# EAGLE design BaseModule (EAGLE 9.6.2)
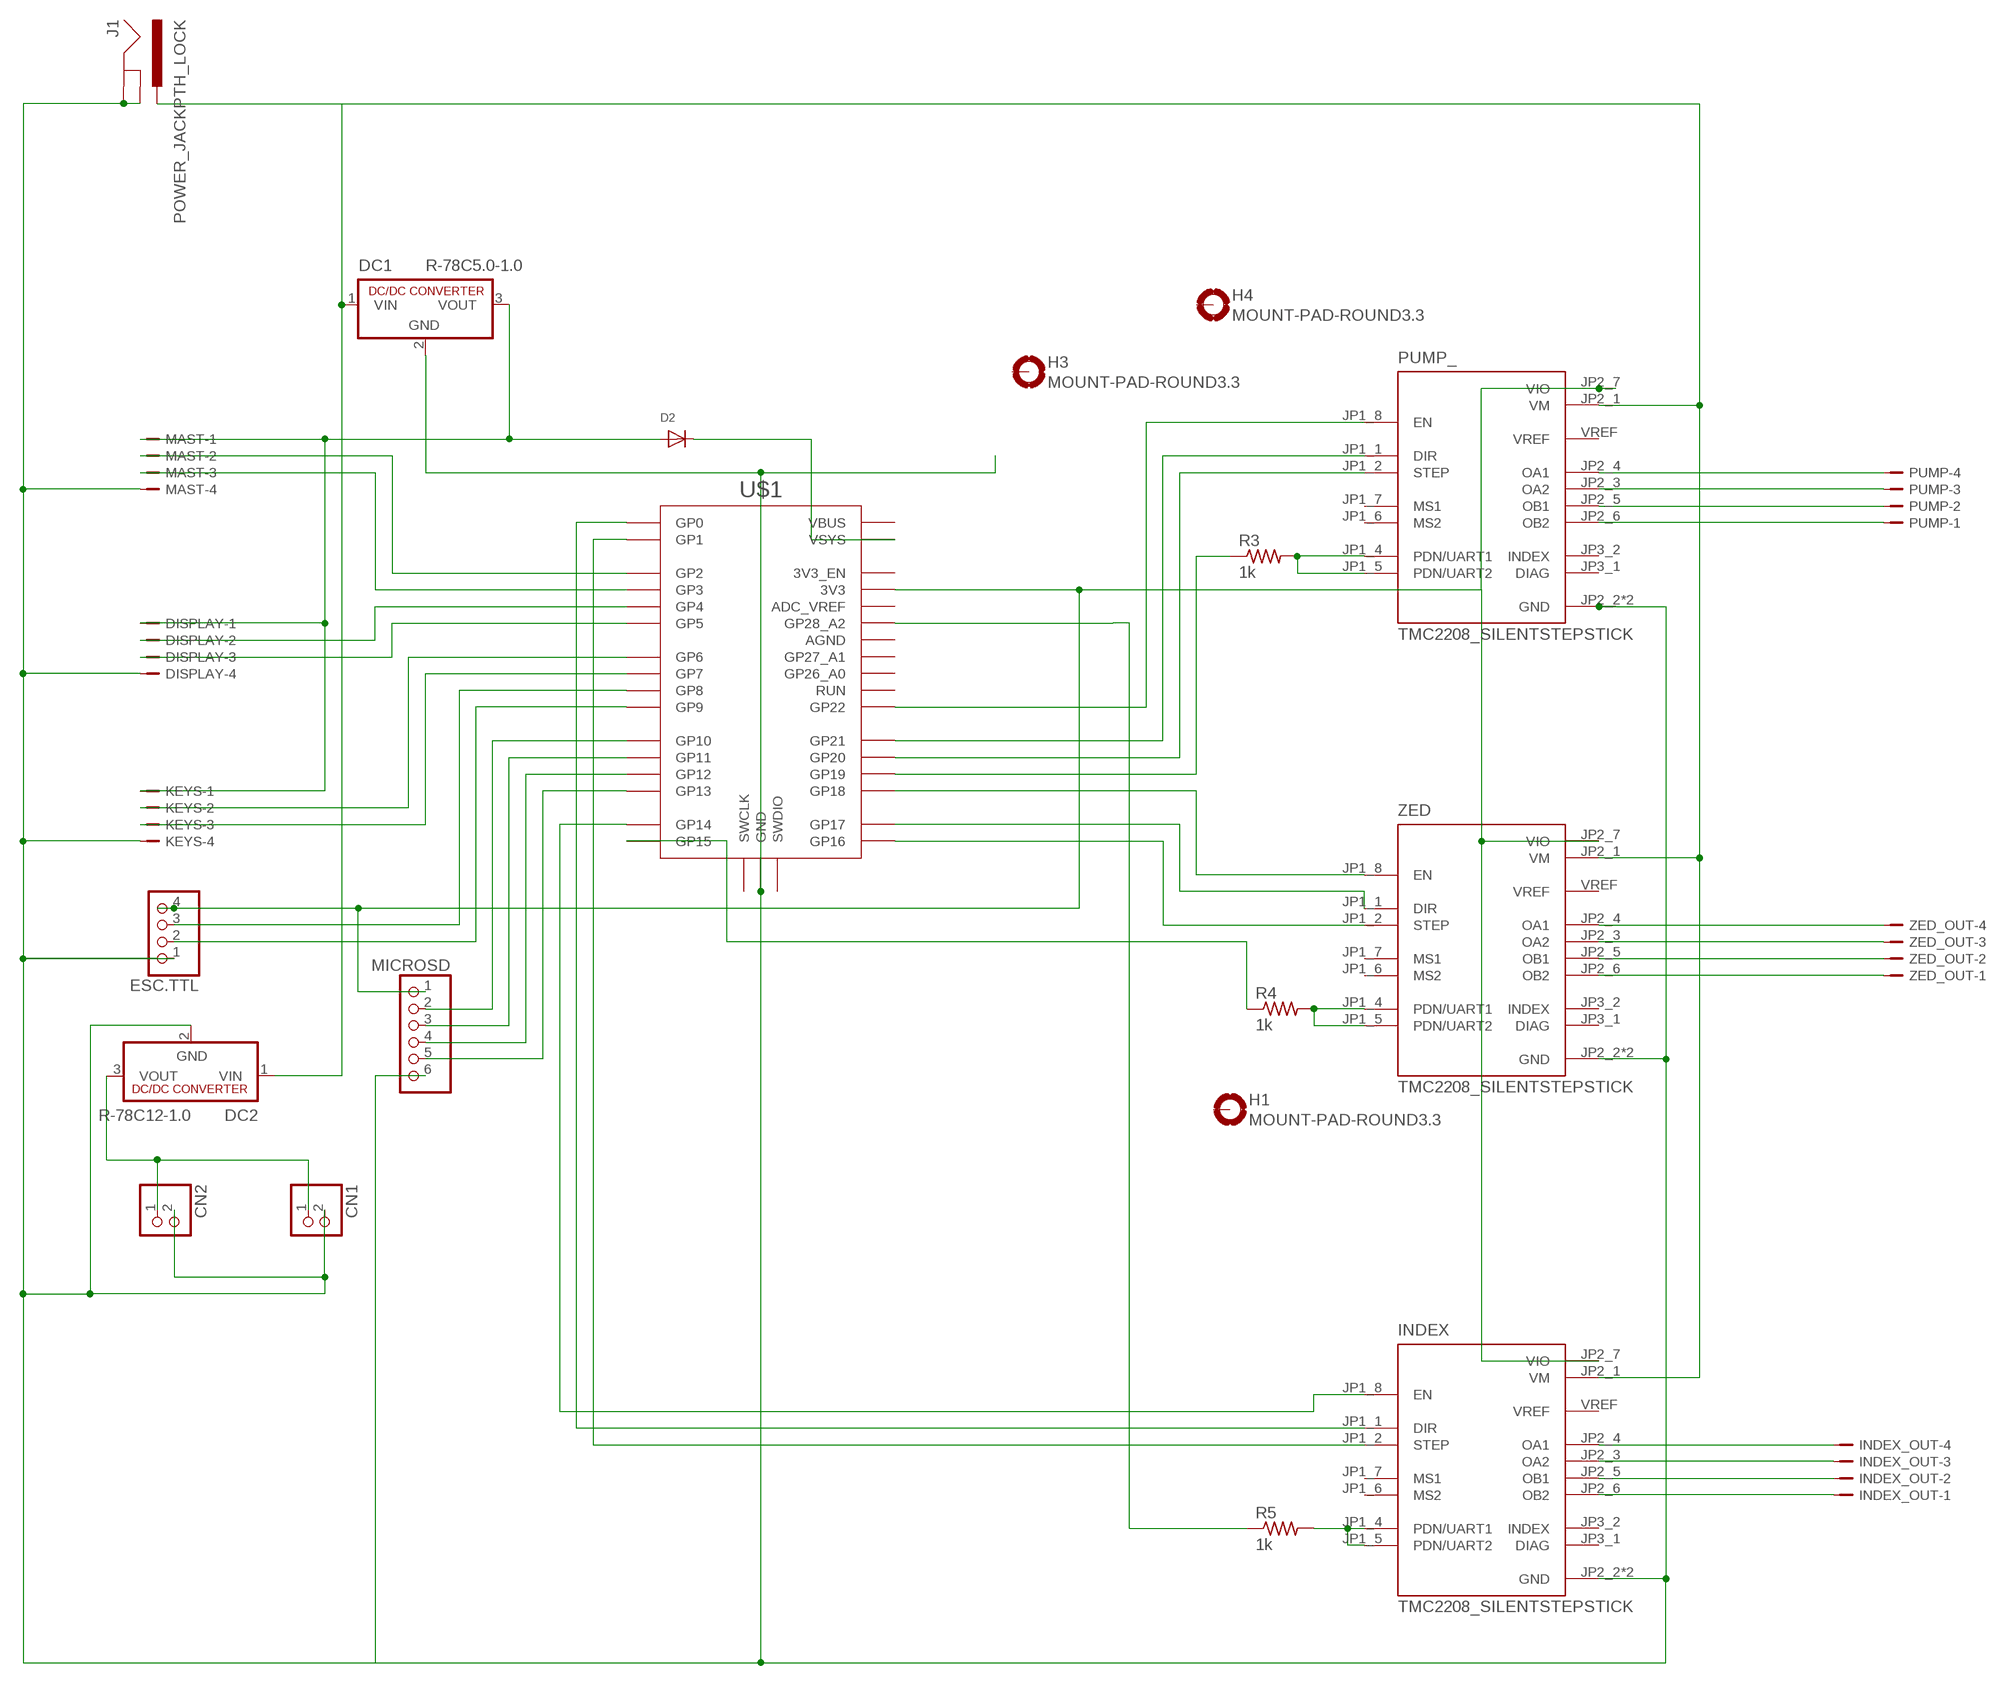
[diagram p0: schematic, sheet 1]

## Parts
CN1  JST_2PIN-THM-RA  [JST-PH-2-THM-RA]
CN2  JST_2PIN-THM-RA  [JST-PH-2-THM-RA]
D2  DIODESMA  [SMADIODE]
DC1  R-78C5.0-1.0  [SIP3]
DC2  R-78C12-1.0  [SIP3]
DISPLAY  JST-PH-4_TH-V  [B4B-PH-K-S]
ESC.TTL  PINHD-1X4  [1X04]
H1  MOUNT-PAD-ROUND3.3  [3,3-PAD]
H3  MOUNT-PAD-ROUND3.3  [3,3-PAD]
H4  MOUNT-PAD-ROUND3.3  [3,3-PAD]
INDEX  TMC2208_SILENTSTEPSTICK  [MODULE_TMC2208_SILENTSTEPSTICK]
INDEX_OUT  JST-PH-4_TH-RA  [S4B-PH-KL]
J1  POWER_JACKPTH_LOCK  [POWER_JACK_PTH_LOCK]
KEYS  JST-PH-4_TH-V  [B4B-PH-K-S]
MAST  JST-PH-4_TH-V  [B4B-PH-K-S]
MICROSD  PINHD-1X6  [1X06]
PUMP  JST-PH-4_TH-RA  [S4B-PH-KL]
PUMP_  TMC2208_SILENTSTEPSTICK  [MODULE_TMC2208_SILENTSTEPSTICK]
R3  1k  R-US_R1206  [R1206]
R4  1k  R-US_R1206  [R1206]
R5  1k  R-US_R1206  [R1206]
U$1  RPI_PICO-TH  [RPI_PICO_TH]
ZED  TMC2208_SILENTSTEPSTICK  [MODULE_TMC2208_SILENTSTEPSTICK]
ZED_OUT  JST-PH-4_TH-RA  [S4B-PH-KL]

## Nets
5V: D2.C U$1.VSYS
GND: CN1.2 CN2.2 DC1.2(GND) DC2.2(GND) DISPLAY.4 ESC.TTL.1 INDEX.JP2_2(GND) INDEX.JP2_8(GND) J1.GND J1.GNDBREAK KEYS.4 MAST.4 MICROSD.6 PUMP_.JP2_2(GND) PUMP_.JP2_8(GND) U$1.GND@1(GND) U$1.GND@2(GND) U$1.GND@3(GND) U$1.GND@4(GND) U$1.GND@5(GND) U$1.GND@6(GND) U$1.GND@7(GND) U$1.GND@8(GND) ZED.JP2_2(GND) ZED.JP2_8(GND)
KEYS: KEYS.2 U$1.GP6
N$1: MICROSD.2 U$1.GP10
N$2: MICROSD.3 U$1.GP11
N$3: PUMP_.JP1_4(PDN/UART1) PUMP_.JP1_5(PDN/UART2) R3.2
N$4: R4.2 ZED.JP1_4(PDN/UART1) ZED.JP1_5(PDN/UART2)
N$5: DC1.1(VIN) DC2.1(VIN) INDEX.JP2_1(VM) J1.PWR PUMP_.JP2_1(VM) ZED.JP2_1(VM)
N$6: U$1.GP18 ZED.JP1_8(EN)
N$7: INDEX.JP2_4(OA1) INDEX_OUT.4
N$8: MICROSD.4 U$1.GP12
N$9: ESC.TTL.4 INDEX.JP2_7(VIO) MICROSD.1 PUMP_.JP2_7(VIO) U$1.3V3 ZED.JP2_7(VIO)
N$10: MICROSD.5 U$1.GP13
N$12: R4.1 U$1.GP15
N$13: D2.A DC1.3(VOUT) DISPLAY.1 KEYS.1 MAST.1
N$14: INDEX.JP2_3(OA2) INDEX_OUT.3
N$15: ZED.JP2_4(OA1) ZED_OUT.4
N$16: ZED.JP2_3(OA2) ZED_OUT.3
N$17: ZED.JP2_5(OB1) ZED_OUT.2
N$18: ZED.JP2_6(OB2) ZED_OUT.1
N$19: PUMP.4 PUMP_.JP2_4(OA1)
N$20: PUMP.3 PUMP_.JP2_3(OA2)
N$21: PUMP.2 PUMP_.JP2_5(OB1)
N$22: PUMP.1 PUMP_.JP2_6(OB2)
N$23: U$1.GP17 ZED.JP1_1(DIR)
N$24: U$1.GP16 ZED.JP1_2(STEP)
N$26: PUMP_.JP1_8(EN) U$1.GP22
N$27: PUMP_.JP1_1(DIR) U$1.GP21
N$28: PUMP_.JP1_2(STEP) U$1.GP20
N$29: R3.1 U$1.GP19
N$30: MAST.2 U$1.GP2
N$31: MAST.3 U$1.GP3
N$32: DISPLAY.2 U$1.GP4
N$33: DISPLAY.3 U$1.GP5
N$35: KEYS.3 U$1.GP7
N$41: ESC.TTL.3 U$1.GP8
N$42: INDEX.JP2_5(OB1) INDEX_OUT.2
N$46: ESC.TTL.2 U$1.GP9
N$50: CN1.1 CN2.1 DC2.3(VOUT)
N$53: INDEX.JP2_6(OB2) INDEX_OUT.1
N$54: INDEX.JP1_8(EN) U$1.GP14
N$55: R5.1 U$1.GP28_A2
N$56: INDEX.JP1_4(PDN/UART1) INDEX.JP1_5(PDN/UART2) R5.2
N$57: INDEX.JP1_1(DIR) U$1.GP0
N$58: INDEX.JP1_2(STEP) U$1.GP1
Unconnected: H1.B3,3(MOUNT) H3.B3,3(MOUNT) H4.B3,3(MOUNT) INDEX.JP1_6(MS2) INDEX.JP1_7(MS1) INDEX.JP3_1(DIAG) INDEX.JP3_2(INDEX) INDEX.VREF PUMP_.JP1_6(MS2) PUMP_.JP1_7(MS1) PUMP_.JP3_1(DIAG) PUMP_.JP3_2(INDEX) PUMP_.VREF U$1.3V3_EN U$1.ADC_VREF U$1.AGND U$1.GP26_A0 U$1.GP27_A1 U$1.RUN U$1.SWCLK U$1.SWDIO U$1.VBUS ZED.JP1_6(MS2) ZED.JP1_7(MS1) ZED.JP3_1(DIAG) ZED.JP3_2(INDEX) ZED.VREF

## Library data of the parts
CN1 CN2 = adafruit:JST_2PIN: JST 2-Pin Connectors of various flavors SMT-RA (S2B-PH-SM4) 4UConnector #17311 SMT (B2B-PH-SM4) THM-RA (S2B-PH) THM (B2B-PH)
D2 = adafruit:DIODE: Diode SMADIODE - SMA Surface Mount Package 20V 1A Schottky Diode Digikey: 641-1014-6-ND DO-1N4148 - Through Hole Small Current Diode SOD-123 20V 1 A (.5mV Vf) Schottky Diode - Digikey: MBRX120TPMSCT-ND SOD-323 10V 570mA (.38mV Vf, 3ns) Schottky Diode - Digikey: ZLLS410CT-ND SOD-523 30V 30mA Schottky Diode (RB751S-40TE61) - Digikey: RB751S-40TE61CT-ND SOT23-R/W - SOT23 Package (R = Solder Paste/Reflow Ovens, W = Hand-Soldering) BAT54Film 40V 300mA - Digikey: 497-7162-1-ND
DC1 DC2 = dc-dc-converter:R-78C*-1.0: INNOLINE DC/DC-Converter 1.0 AMP SIP3 Single Output Source: Data sheet <http://www.mikrocontroller.net/attachment/150645/157764-da-01-en-DC_DC_WANDLER_R_78C5_0_1_0.pdf>
DISPLAY KEYS MAST = con-JST-PH:JST-PH-4; MF: JST; MPN: B4B-PH-K-S
ESC.TTL = pinhead:PINHD-1X4: PIN HEADER
H1 H3 H4 = holes:MOUNT-PAD-ROUND: MOUNTING PAD, round
INDEX PUMP_ ZED = TMC2208_SILENTSTEPSTICK:TMC2208_SILENTSTEPSTICK: Check availability <https://pricing.snapeda.com/parts/TMC2208%20SILENTSTEPSTICK/Trinamic%20Motion/view-part?ref=eda>; AVAILABILITY: In Stock; CHECK_PRICES: https://www.snapeda.com/parts/TMC2208%20SILENTSTEPSTICK/Trinamic/view-part/?ref=eda; DESCRIPTION: TMC2208 Motor Controller/Driver, Stepper Power Management Evaluation Board; MF: Trinamic Motion; MP: TMC2208 SILENTSTEPSTICK; PACKAGE: None; PRICE: None; SNAPEDA_LINK: https://www.snapeda.com/parts/TMC2208%20SILENTSTEPSTICK/Trinamic/view-part/?ref=snap
INDEX_OUT PUMP ZED_OUT = con-JST-PH:JST-PH-4; MF: JST; MPN: S4B-PH-KL
J1 = SparkFun-Connectors:POWER_JACK: Power Jack Connector This is the standard 5.5mm barrel jack for power. The PTH is the most common, proven, reliable, footprint. The Slot footprint only works if the mill layer is transmitted to the PCB fab house so be warned. Here are the connectors we sell at SparkFun: DC Barrel Power Jack/Connector <https://www.sparkfun.com/products/119> (PRT-00119) DC Barrel Power Jack/Connector (SMD) <https://www.sparkfun.com/products/12748> (PRT-12748) DC Barrel Jack Adapter - Breadboard Compatible <https://www.sparkfun.com/products/10811> (PRT-10811) It is used on this SparkFun product (and many, many others): SparkFun RedBoard - Programmed with Arduino <https://www.sparkfun.com/products/12757> (DEV-12757) Also, if you need a mating power supply or connector, please check these out: Wall Adapter Power Supply - 9VDC 650mA <https://www.sparkfun.com/products/298> (TOL-00298) DC Barrel Jack Adapter - Male <https://www.sparkfun.com/products/10287> (PRT-10287); PROD_ID: CONN-08197; SF_ID: PRT-00119
MICROSD = adafruit:PINHD-1X6: PIN HEADER
R3-R5 = adafruit:R-US_: RESISTOR, American symbol
U$1 = RaspberryPi_Pico:RPI_PICO

## Board
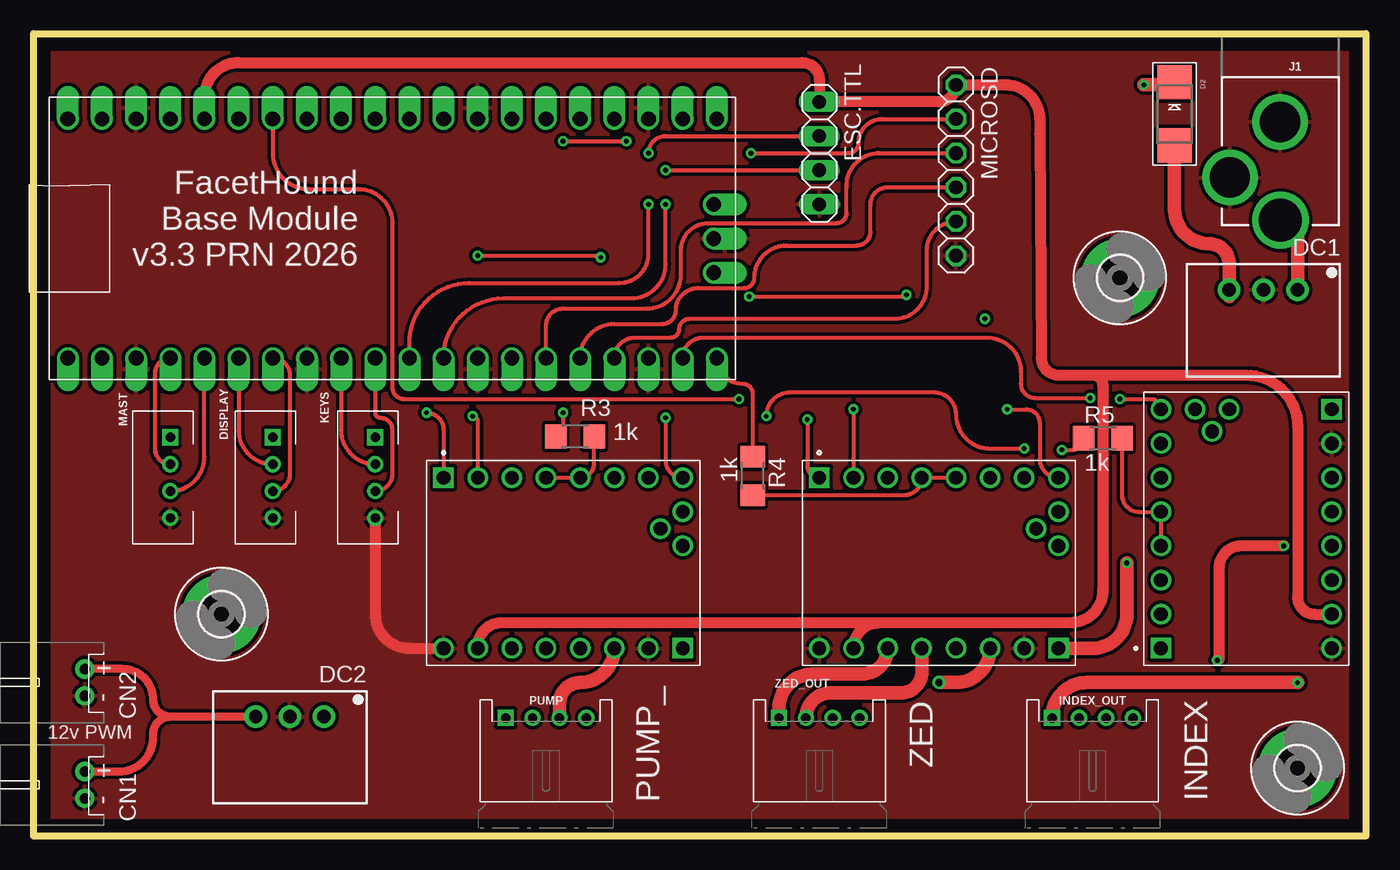
[diagram p1: board, top side]
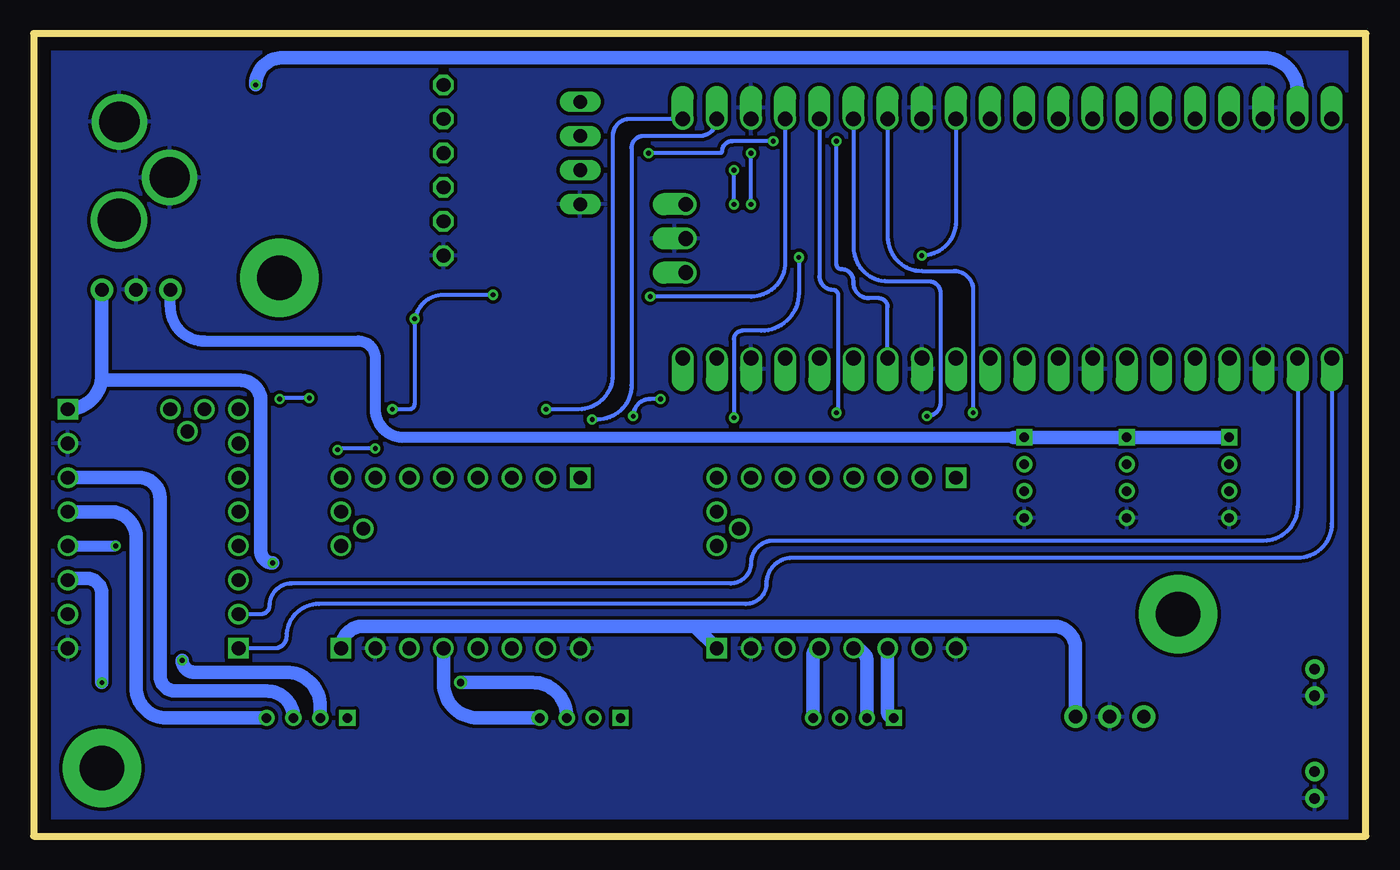
[diagram p2: board, bottom side, seen from below]

Size 99.06 x 59.69 mm. Coordinates in mm from the lower left corner, seen from the top.
Outline: 0,0 0,59.69 99.06,59.69 99.06,0 0,0
Copper layers (1*16): Top 0.035mm / dielectric 1.5mm / Bottom 0.035mm
Design rules "default": minimum track width 6mil, minimum drill 0.35mm, track to track 6mil, track to pad 6mil, pad to pad 6mil, via to via 6mil, smd to smd 6mil, copper to edge 40mil, drill to drill 6mil, minimum pad ring 10mil, minimum via ring 8mil, stop-mask expansion 4mil, vias tented up to drill 0mil, thermal gap 10mil

### Footprints (pad centres in the part's own frame; a part is rotated, then mirrored left to right if it is on the bottom)
JST-PH-2-THM-RA = drill 0.8 pad 1.422: 1 1,0; 2 -1,0
SMADIODE = smd 2.54 x 2.54: A 2.349,0; C -2.349,0
SIP3 = drill 1 pad 1.676: 1 -2.54,0; 2 0,0; 3 2.54,0
B4B-PH-K-S = drill 0.7 square: 1 3,0 | drill 0.7: 2 1,0; 3 -1,0; 4 -3,0
1X04 = drill 1.016 long: 1 -3.81,0; 2 -1.27,0; 3 1.27,0; 4 3.81,0
3,3-PAD = drill 3.3 pad 5.842: B3,3 0,0
MODULE_TMC2208_SILENTSTEPSTICK = drill 1.016 square: JP1_1 6.35,8.89; JP2_1 -6.35,-8.89 | drill 1.016: JP1_2 6.35,6.35; JP1_3 6.35,3.81; JP1_4 6.35,1.27; JP1_5 6.35,-1.27; JP1_6 6.35,-3.81; JP1_7 6.35,-6.35; JP1_8 6.35,-8.89; JP2_2 -6.35,-6.35; JP2_3 -6.35,-3.81; JP2_4 -6.35,-1.27; JP2_5 -6.35,1.27; JP2_6 -6.35,3.81; JP2_7 -6.35,6.35; JP2_8 -6.35,8.89; JP3_1 1.27,-8.89; JP3_2 3.81,-8.89; VREF 2.54,-7.239
S4B-PH-KL = drill 0.7 square: 1 3,-3.72 | drill 0.7: 2 1,-3.72; 3 -1,-3.72; 4 -3,-3.72
POWER_JACK_PTH_LOCK = drill 2.997 pad 4.115: GND 0.025,6.557; GNDBREAK 3.762,10.7 | drill 3.2 pad 4.115: PWR 0,13.878
1X06 = drill 1.016 octagon: 1 -6.35,0; 2 -3.81,0; 3 -1.27,0; 4 1.27,0; 5 3.81,0; 6 6.35,0
R1206 = smd 1.6 x 1.803: 1 -1.422,0; 2 1.422,0
RPI_PICO_TH = drill 1.1 pad 1.6 offset: 3V3 8.89,13.97; 3V3_EN 8.89,16.51; ADC_VREF 8.89,11.43; AGND 8.89,6.35; GND@1 -8.89,19.05; GND@2 -8.89,6.35; GND@3 -8.89,-6.35; GND@4 -8.89,-19.05; GND@5 0,-23.9; GND@6 8.89,-19.05; GND@7 8.89,-6.35; GND@8 8.89,19.05; GP0 -8.89,24.13; GP1 -8.89,21.59; GP2 -8.89,16.51; GP3 -8.89,13.97; GP4 -8.89,11.43; GP5 -8.89,8.89; GP6 -8.89,3.81; GP7 -8.89,1.27; GP8 -8.89,-1.27; GP9 -8.89,-3.81; GP10 -8.89,-8.89; GP11 -8.89,-11.43; GP12 -8.89,-13.97; GP13 -8.89,-16.51; GP14 -8.89,-21.59; GP15 -8.89,-24.13; GP16 8.89,-24.13; GP17 8.89,-21.59; GP18 8.89,-16.51; GP19 8.89,-13.97; GP20 8.89,-11.43; GP21 8.89,-8.89; GP22 8.89,-3.81; GP26_A0 8.89,1.27; GP27_A1 8.89,3.81; GP28_A2 8.89,8.89; RUN 8.89,-1.27; SWCLK -2.54,-23.9; SWDIO 2.54,-23.9; VBUS 8.89,24.13; VSYS 8.89,21.59

### Placement (x,y rotation side)
CN1  3.81,3.81 90 top
CN2  3.81,11.43 90 top
D2  84.84,53.72 270 top
DC1  91.44,40.64 180 top
DC2  19.05,8.89 180 top
DISPLAY  17.78,26.67 90 top
ESC.TTL  58.42,50.8 90 top
H1  80.77,41.53 0 top
H3  93.98,5.08 0 top
H4  13.97,16.51 0 top
INDEX  90.17,22.86 180 top
INDEX_OUT  78.74,5.08 180 top
J1  92.71,59.69 180 top
KEYS  25.4,26.67 90 top
MAST  10.16,26.67 90 top
MICROSD  68.58,49.53 270 top
PUMP  38.1,5.08 180 top
PUMP_  39.37,20.32 90 top
R3  40.26,29.72 0 top
R4  53.47,26.8 270 top
R5  79.5,29.59 0 top
U$1  26.67,44.45 90 top
ZED  67.31,20.32 90 top
ZED_OUT  58.42,5.08 180 top

### Tracks (layer width: path | path; a pad name or v marks a point on that pad's centre or on a via)
5V  (via drill 0.35)
  Top 1.016: v82.55,55.88 85.09,55.88 arc90 84.9,56.07 D2.C
  Bottom 1.016: 5.08,54.61 U$1.VSYS 5.08,55.37 arc-90 7.62,57.91 80.52,57.91 arc-90 v82.55,55.88
GND
  Top 0.813: KEYS.4 25.4,16.51 arc90 27.94,13.97 PUMP_.JP2_8
  pour Bottom (isolate 0.254): 0,59.69 0,1.27 99.06,1.27 99.06,59.69
  pour Top (isolate 0.254): 0,59.69 0,1.27 99.06,1.27 99.06,59.69
KEYS
  Top 0.305: U$1.GP6 22.86,30.21 arc90 KEYS.2
N$1  (via drill 0.35)
  Top 0.305: v53.34,50.8 60.58,50.8 arc90 61.34,51.56 arc-90 63.12,53.34 MICROSD.2 | v39.37,51.69 v44.07,51.69
  Bottom 0.305: U$1.GP10 35.56,39.37 arc-90 36.2,40.01 36.96,40.01 arc90 38.1,41.15 38.1,41.27 arc-90 38.99,42.16 arc90 39.37,42.55 v39.37,51.69 | v53.34,50.8 48.01,50.8 arc-90 47.88,50.93 arc90 47.12,51.69 v44.07,51.69
N$2
  Top 0.305: U$1.GP11 38.1,37.97 arc-90 39.37,39.24 45.59,39.24 arc90 48.13,41.78 48.13,43.56 arc-90 50.16,45.59 59.69,45.59 arc90 60.45,46.35 60.45,48.26 60.45,48.39 | 60.45,48.39 60.45,48.51 | 62.74,50.8 62.87,50.8 | 62.87,50.8 MICROSD.3 | 60.45,48.39 arc-90 62.87,50.8
N$3
  Top 0.305: 41.15,29.72 R3.2 41.68,27.71 arc-90 PUMP_.JP1_5 PUMP_.JP1_4
N$4
  Top 0.305: R4.2 64.75,25.38 arc90 ZED.JP1_4 ZED.JP1_5
N$5  (via drill 0.35)
  Top 1.016: DC1.1 93.98,44.54 arc90 J1.PWR 93.34,45.81 | v81.28,20.32 81.28,16.51 arc-90 78.74,13.97 ZED.JP2_1
  Bottom 1.016: DC1.1 93.98,34.29 | 93.98,34.29 93.98,33.91 83.69,33.91 arc90 82.17,32.38 82.17,21.21 arc-90 v81.28,20.32 | PUMP_.JP2_1 49.91,15.62 | ZED.JP2_1 arc90 74.55,15.62 49.91,15.62 | 93.98,34.29 arc90 INDEX.JP2_1 | 49.91,15.62 23.24,15.62 arc90 21.59,13.97 DC2.1
N$6  (via drill 0.35)
  Top 0.305: v72.39,31.75 73.79,31.75 arc-90 74.8,30.73 74.8,28.07 arc90 ZED.JP1_8 | v53.21,40.13 64.77,40.13 arc90 v64.9,40.26
  Bottom 0.305: U$1.GP18 43.18,42.67 arc90 45.72,40.13 v53.21,40.13 | v70.74,38.48 70.74,38.1 | 70.74,38.1 70.74,32.13 arc90 71.12,31.75 v72.39,31.75 | v64.9,40.26 68.58,40.26 arc-90 70.74,38.1
N$7
  Bottom 1.016: INDEX_OUT.4 89.19,8.8 arc90 91.44,11.05 91.44,22.23 arc-90 93.34,24.13 INDEX.JP2_4
N$8
  Top 0.305: U$1.GP12 arc-90 43.18,38.1 46.74,38.1 arc90 47.75,39.12 arc-90 49.4,40.77 52.83,40.77 arc90 53.59,41.53 arc-90 56.01,43.94 61.21,43.94 arc90 62.23,44.96 62.23,46.99 arc-90 63.5,48.26 MICROSD.4
N$9
  Top 0.305: 60.96,14.22 ZED.JP2_7 arc-90 62.87,15.88
  Top 0.813: U$1.3V3 12.7,54.99 arc-90 15.24,57.53 57.15,57.53 arc-90 58.42,56.26 ESC.TTL.4 67.31,54.61 arc90 MICROSD.1 72.26,55.88 arc-90 74.8,53.34 74.8,52.2 74.93,35.56 arc90 76.2,34.29 78.74,34.29 | 78.74,34.29 arc-90 79.5,33.53 79.5,18.29 arc-90 77.09,15.88 62.87,15.88 | ZED.JP2_7 arc-90 62.87,15.88 | 62.87,15.88 34.8,15.88 arc90 33.02,14.1 PUMP_.JP2_7 | 78.74,34.29 90.17,34.29 arc-90 93.98,30.48 93.98,17.78 arc90 95.25,16.51 INDEX.JP2_7
N$10
  Top 0.305: U$1.GP13 arc-90 44.7,37.08 47.37,37.08 arc90 48.01,37.72 arc-90 48.77,38.48 64.01,38.48 arc90 66.42,40.89 66.42,43.56 arc-90 MICROSD.5
N$12
  Top 0.305: U$1.GP15 arc90 52.7,33.66 arc-90 53.47,32.89 R4.1
N$13
  Top 1.016: 88.9,40.13 DC1.3 88.9,42.55 arc90 87.38,44.07 arc-90 84.84,46.61 D2.A
  Bottom 0.813: KEYS.1 71.58,29.67 arc90 73.66,31.75 73.66,35.56 arc-90 74.93,36.83 86.36,36.83 arc90 88.9,39.37 DC1.3
  Bottom 1.016: 26.21,29.67 KEYS.1 DISPLAY.1 MAST.1
N$14
  Bottom 1.016: INDEX_OUT.3 arc-90 81.73,10.79 88.52,10.79 arc90 89.66,11.94 89.66,25.15 arc-90 91.19,26.67 INDEX.JP2_3
N$15
  Bottom 1.016: ZED_OUT.4 66.04,8.8 arc90 68.58,11.34 ZED.JP2_4
N$16  (via drill 0.55)
  Top 1.016: v67.31,11.43 68.58,11.43 arc90 ZED.JP2_3
  Bottom 1.016: ZED_OUT.3 59.42,8.89 arc-90 61.96,11.43 v67.31,11.43
N$17
  Top 1.016: ZED_OUT.2 arc-90 59.29,10.67 64.52,10.67 arc90 66.04,12.19 ZED.JP2_5
N$18
  Top 1.016: ZED_OUT.1 55.42,9.53 arc-90 57.96,12.06 61.59,12.06 arc90 ZED.JP2_6
N$19
  Bottom 1.016: PUMP_.JP2_4 arc-90 41.1,13.51 PUMP.4
N$20
  Top 1.016: PUMP.3 39.1,9.89 arc-90 40.64,11.43 arc90 PUMP_.JP2_3
N$21
  Bottom 1.016: PUMP_.JP2_5 arc90 37.08,12.95 37.08,8.82 arc90 PUMP.2
N$22
  Bottom 1.016: PUMP_.JP2_6 35.56,9.26 arc-90 PUMP.1
N$23  (via drill 0.35)
  Top 0.305: v57.53,30.99 57.53,27.56 arc90 ZED.JP1_1
  Bottom 0.305: U$1.GP17 arc90 49.53,52.07 53.72,52.07 arc-90 54.61,51.18 | 54.61,33.53 arc90 57.15,30.99 v57.53,30.99 | 54.61,51.18 54.61,33.53 | 54.61,51.18 54.61,33.53
N$24  (via drill 0.35)
  Top 0.305: v60.96,31.75 ZED.JP1_2
  Bottom 0.305: 51.03,53.34 U$1.GP16 54.74,53.34 arc-90 56.01,52.07 56.01,34.29 arc90 58.55,31.75 v60.96,31.75
N$26  (via drill 0.35)
  Top 0.305: v46.99,31.11 46.99,27.94 arc90 PUMP_.JP1_8 | v33.02,43.18 42.04,43.18 arc-90 v42.16,43.05
  Bottom 0.305: U$1.GP22 30.48,45.72 arc90 v33.02,43.18 | v42.16,43.05 42.16,40.39 arc90 44.96,37.59 46.35,37.59 arc-90 46.99,36.96 v46.99,31.11
N$27  (via drill 0.35)
  Top 0.305: v29.21,31.5 arc-90 30.48,30.23 PUMP_.JP1_1
  Bottom 0.305: U$1.GP21 35.56,44.58 arc-90 33.02,42.04 30.61,42.04 arc90 29.21,40.64 v29.21,31.5
N$28  (via drill 0.35)
  Top 0.305: v32.64,31.24 arc-90 33.02,30.86 PUMP_.JP1_2
  Bottom 0.305: 38.1,54.61 U$1.GP20 38.1,43.81 arc-90 35.56,41.27 32.51,41.27 arc90 31.62,40.39 31.62,32.26 arc90 v32.64,31.24
N$29  (via drill 0.35)
  Top 0.305: v39.37,31.5 39.37,30.25 arc-90 R3.1
  Bottom 0.305: U$1.GP19 40.64,41.66 arc-90 39.62,40.64 arc90 39.24,40.26 39.24,31.5 v39.37,31.5
N$30
  Top 0.305: U$1.GP2 arc90 9.02,34.42 9.02,28.81 arc90 MAST.2
N$31
  Top 0.305: MAST.3 arc90 12.7,28.21 U$1.GP3
N$32
  Top 0.305: U$1.GP4 15.24,30.21 arc90 DISPLAY.2
N$33
  Top 0.305: U$1.GP5 arc-90 19.05,34.29 19.05,26.94 arc-90 DISPLAY.3
N$35
  Top 0.305: U$1.GP7 25.4,31.5 arc90 25.78,31.11 arc-90 26.67,30.23 26.67,26.94 arc-90 KEYS.3
N$41  (via drill 0.35)
  Top 0.305: U$1.GP8 27.94,36.7 arc-90 32.38,41.15 43.56,41.15 arc90 45.72,43.31 v45.72,46.99 | v45.72,50.8 arc-90 46.99,52.07 ESC.TTL.3
  Bottom 0.305: v45.72,46.99 v45.72,50.8
N$42  (via drill 0.35)
  Top 0.813: v92.96,21.59 89.79,21.59 arc90 88.14,19.94 88.14,13.21 arc-90 v88.01,13.08
  Bottom 0.813: INDEX.JP2_5 v92.96,21.59
  Bottom 1.016: INDEX_OUT.2 77.74,9.65 arc-90 80.28,12.19 87.12,12.19 arc90 v88.01,13.08
N$46  (via drill 0.35)
  Top 0.305: U$1.GP9 arc-90 34.92,40.01 44.45,40.01 arc90 46.99,42.55 v46.99,46.99 | v46.99,49.53 ESC.TTL.2
  Bottom 0.305: v46.99,46.99 v46.99,49.53
N$50
  Top 0.61: DC2.3 10.16,8.89 | 10.16,8.89 arc-90 8.89,10.16 arc90 6.62,12.43 CN2.1 | CN1.1 6.35,4.81 arc90 8.89,7.35 8.89,7.62 arc-90 10.16,8.89
N$53  (via drill 0.35)
  Top 1.016: INDEX_OUT.1 75.74,8.89 arc-90 78.28,11.43 v93.98,11.43
  Bottom 1.016: v93.98,11.43 93.98,18.03 arc-90 95.12,19.18 96.39,19.18 arc-90 INDEX.JP2_6
N$54  (via drill 0.35)
  Top 0.305: 48.26,35.31 U$1.GP14 arc-90 49.78,37.08 70.87,37.08 arc-90 73.41,34.54 73.41,33.66 arc90 74.47,32.59 v78.56,32.59 | v80.77,32.51 83.06,32.51 arc-90 INDEX.JP1_8
  Bottom 0.305: v78.56,32.59 80.69,32.59 arc-90 v80.77,32.51
N$55  (via drill 0.35)
  Top 0.305: 78.74,28.93 arc90 R5.1 arc-90 77.22,28.73 v76.45,28.73 | U$1.GP28_A2 17.78,50.8 arc90 20.45,48.13 24.13,48.13 arc-90 26.67,45.59 26.67,33.4 arc90 27.56,32.51 v52.45,32.51 | v54.48,31.24 arc-90 56.26,33.02 66.93,33.02 arc-90 68.58,31.37 arc90 71.12,28.83 v73.66,28.83
  Bottom 0.305: 17.78,54.61 U$1.GP28_A2 | v52.45,32.51 53.21,32.51 arc-90 v54.48,31.24 | v73.66,28.83 76.36,28.83 arc-90 v76.45,28.73
N$56
  Top 0.305: INDEX.JP1_4 INDEX.JP1_5 82.17,24.13 arc-90 80.92,25.38 R5.2
N$57
  Bottom 0.305: U$1.GP0 2.54,23.24 arc90 5.08,20.7 42.67,20.7 arc-90 44.58,18.8 arc90 46.1,17.27 77.85,17.27 arc-90 80.26,14.86 arc90 81.15,13.97 INDEX.JP1_1
N$58
  Top 0.305: 4.95,35.43 arc-90 U$1.GP1
  Bottom 0.305: U$1.GP1 5.08,24.51 arc90 7.62,21.97 44.07,21.97 arc-90 45.72,20.32 arc90 47.24,18.8 79.88,18.8 arc-90 81.53,17.14 arc90 82.17,16.51 INDEX.JP1_2

### Text on the board
tPlace: FacetHound / Base Module / v3.3 PRN 2026
tNames: 12v PWM
tValues: 3v3 | 3v3 | CS | TX | SCK | RX | MOSI | GND | MISO | GND | 3v3 | TX | RX | GND